# EAGLE design LB_o3_RGB_LED-v03(rev2) (EAGLE 6.6.0)
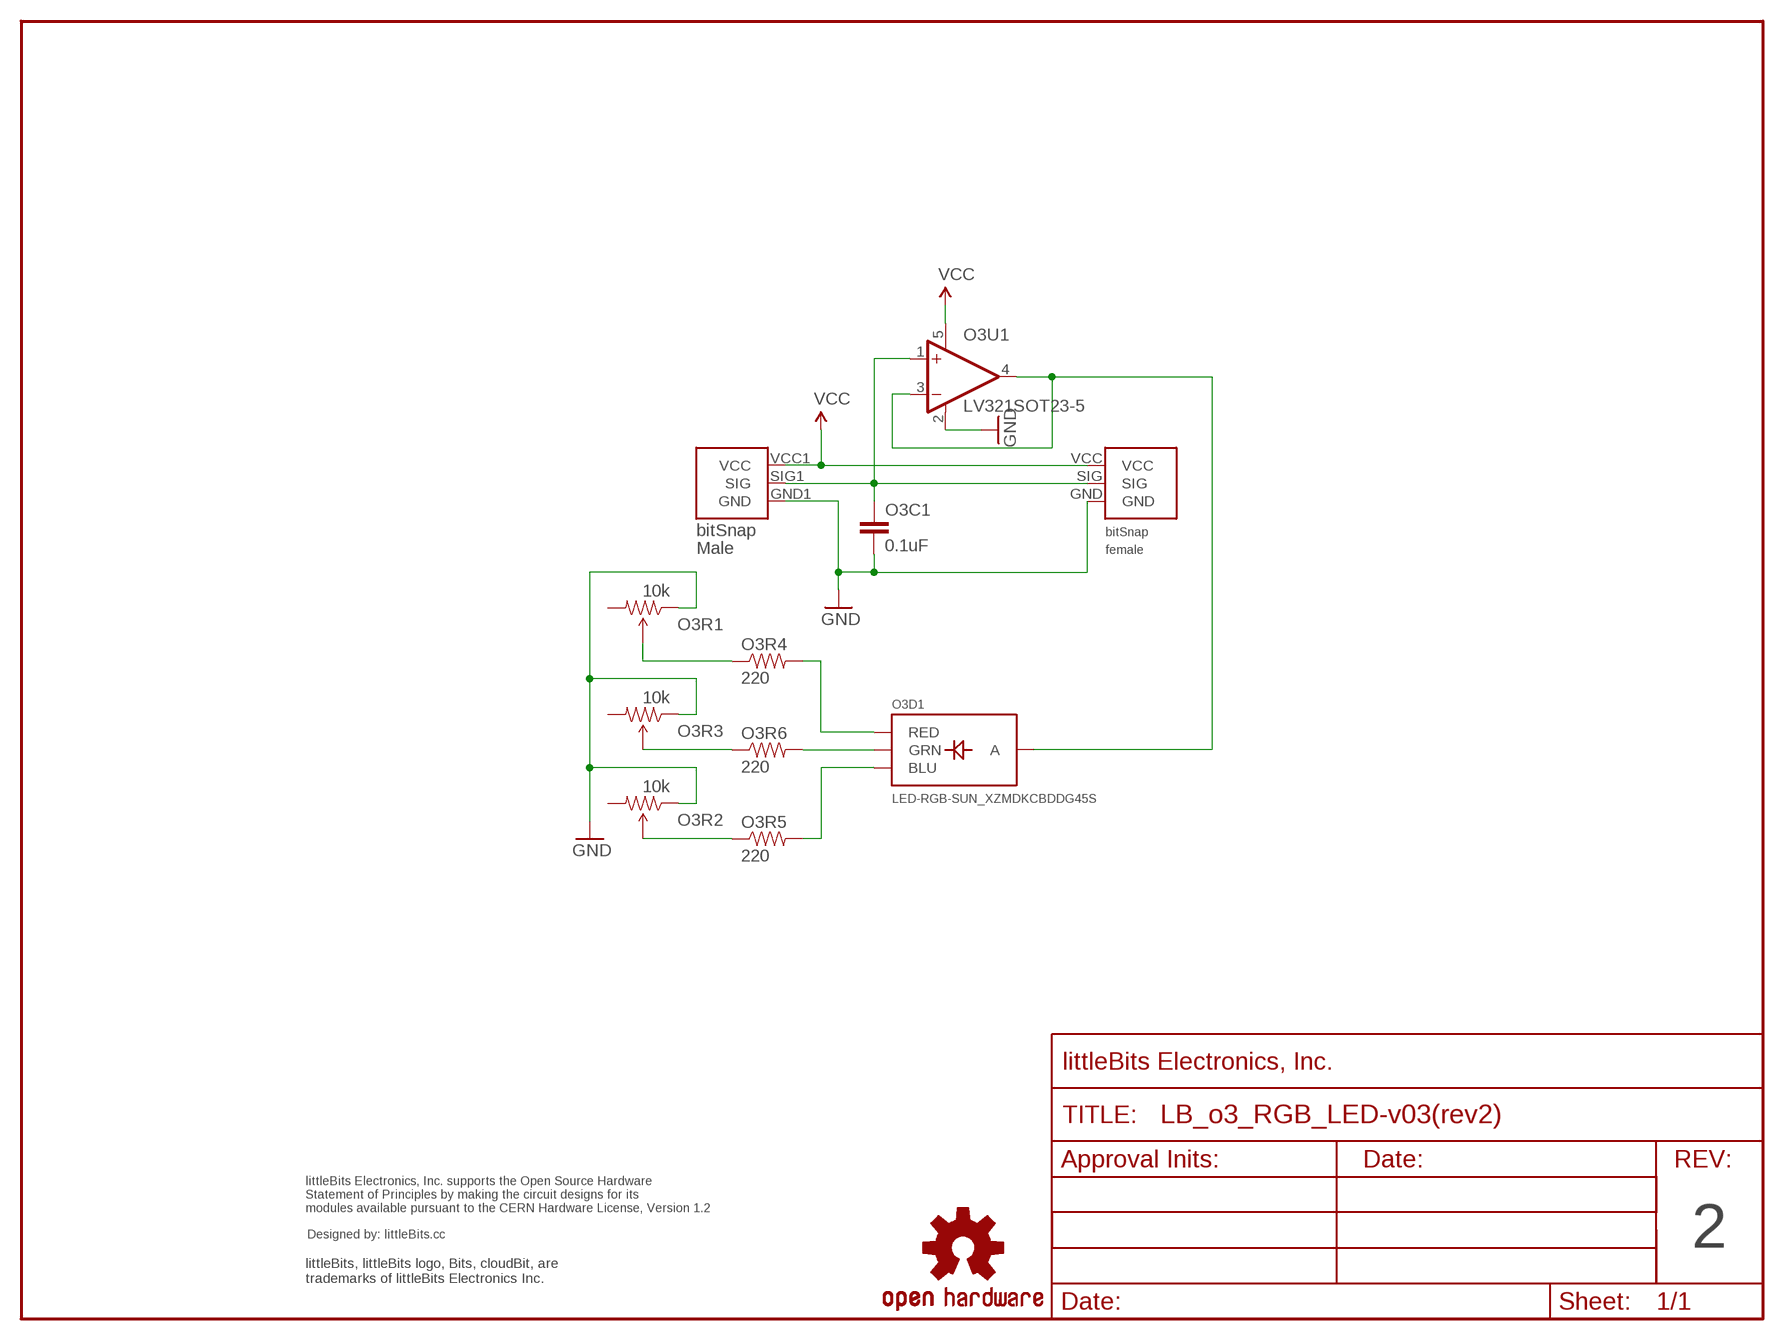
[diagram p0: schematic, sheet 1]

## Parts
O3BSF1  BITSNAP_V03_FEMALE  [BITSNAP_V03_FEMALE]
O3BSM1  BITSNAP_V03_MALE  [BITSNAP_V03_MALE]
O3C1  0.1uF  CAP0603-CAP  [0603-CAP]
O3D1  LED-RGB-SUN_XZMDKCBDDG45S  [LED-RGB-SUN_XZMDKCBDDG45S]
O3R1  10k  TRIMPOTSMD  [TRIMPOT-3MM]
O3R2  10k  TRIMPOTSMD  [TRIMPOT-3MM]
O3R3  10k  TRIMPOTSMD  [TRIMPOT-3MM]
O3R4  220  RESISTOR0603-RES  [0603-RES]
O3R5  220  RESISTOR0603-RES  [0603-RES]
O3R6  220  RESISTOR0603-RES  [0603-RES]
O3U1  LV321SOT23-5  [SOT23-5]
U$1  FRAME-LETTER-OHWOHW  [FABDWG01-OHW]
U$2  OSHWCREDIT  [OSHWCREDIT]
U$5  OSHW-LOGOL  [OSHW-LOGO-L]

## Nets
GND: O3BSF1.GND O3BSM1.GND1(GND) O3C1.2 O3R1.1(CCW) O3R2.1(CCW) O3R3.1(CCW) O3U1.2(V-)
LED: O3D1.2(A) O3U1.3(-IN) O3U1.4(OUT)
N$1: O3R1.2(WIPER) O3R4.1
N$2: O3D1.1(RED) O3R4.2
N$3: O3D1.4(GRN) O3R6.2
N$4: O3D1.3(BLU) O3R5.2
N$5: O3R2.2(WIPER) O3R5.1
N$6: O3R3.2(WIPER) O3R6.1
SIG: O3BSF1.SIG O3BSM1.SIG1(SIG) O3C1.1 O3U1.1(+IN)
VCC: O3BSF1.VCC O3BSM1.VCC1(VCC) O3U1.5(V+)
Unconnected: O3R1.3(CW) O3R2.3(CW) O3R3.3(CW)

## Notes on the sheet
- 2

## Library data of the parts
O3BSF1 = bitSnap:BITSNAP_V03_FEMALE
O3BSM1 = bitSnap:BITSNAP_V03_MALE
O3C1 = SparkFun:CAP: Capacitor Standard 0603 ceramic capacitor, and 0.1" leaded capacitor.
O3D1 = LITTLEBITS:LED-RGB-SUN_XZMDKCBDDG45S
O3R1-O3R3 = SparkFun:TRIMPOT
O3R4-O3R6 = SparkFun:RESISTOR: Resistor Basic schematic elements and footprints for 0603, 1206, and PTH 1/10th watt (small) resistors.
O3U1 = LITTLEBITS:LV321
U$1 = LITTLEBITS:FRAME-LETTER-OHW
U$2 = LITTLEBITS:OSHWCREDIT
U$5 = LITTLEBITS:OSHW-LOGO: Open Source Hardware Logo This logo indicates the piece of hardware it is found on incorporates a OSHW license and/or adheres to the definition of open source hardware found here: http://freedomdefined.org/OSHW

## Board
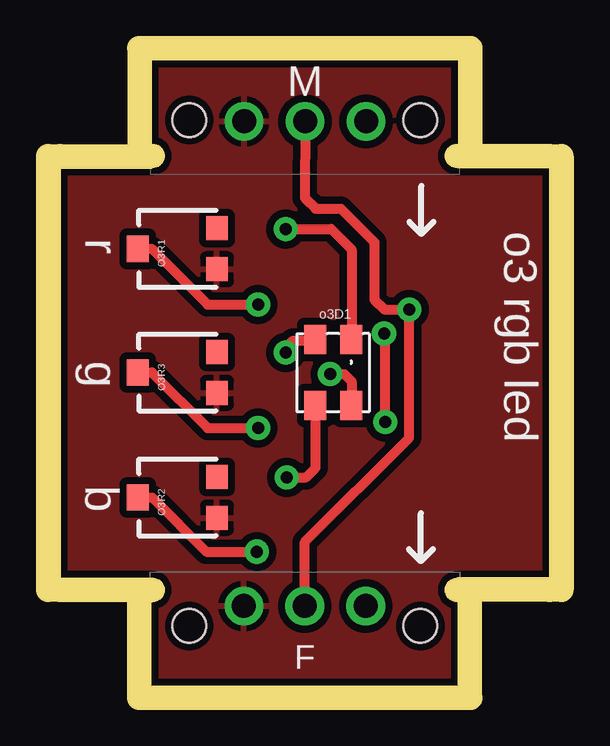
[diagram p1: board, top side]
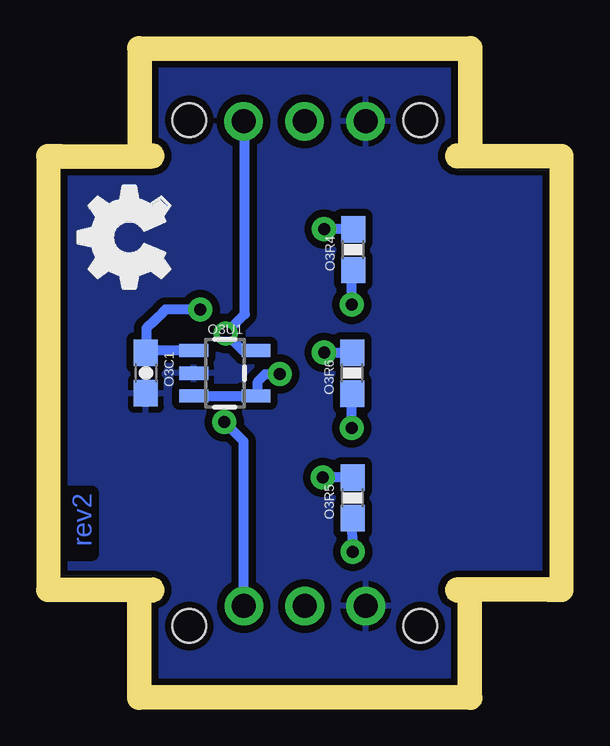
[diagram p2: board, bottom side, seen from below]

Size 20.4 x 26.1 mm. Coordinates in mm from the lower left corner, seen from the top.
Outline: 0,21.6 0,4.5
Outline: 20.4,4.5 20.4,21.6
Copper layers (1*16): Top 0.035mm / dielectric 1.5mm / Bottom 0.035mm
Design rules "default": minimum track width 8mil, minimum drill 20mil, track to track 8mil, track to pad 8mil, pad to pad 8mil, via to via 8mil, smd to smd 8mil, copper to edge 10mil, drill to drill 8mil, minimum pad ring 12mil, minimum via ring 10mil, stop-mask expansion 4mil, vias tented up to drill 25mil, thermal gap 10mil
Milling: 6 lines

### Footprints (pad centres in the part's own frame; a part is rotated, then mirrored left to right if it is on the bottom)
BITSNAP_V03_FEMALE = drill 1: GND 3.91,3.33; SIG 6.45,3.33; VCC 8.99,3.33 | hole 1.4: 1.63,2.5; 11.27,2.5
BITSNAP_V03_MALE = drill 1: GND1 8.98,2.56; SIG1 6.44,2.56; VCC1 3.9,2.56 | hole 1.4: 11.27,2.5; 1.63,2.5
0603-CAP = smd 1.1 x 1: 1 -0.85,0; 2 0.85,0
LED-RGB-SUN_XZMDKCBDDG45S = smd 0.9 x 1.2: 1 0,0; 2 0,2.75; 3 1.5,2.75; 4 1.5,0; 5 1.5,2.75
TRIMPOT-3MM = smd 1 x 0.9: 1 -0.85,-1.65; 3 0.85,-1.65 | smd 1.1 x 0.9: 2 0,1.65
0603-RES = smd 1.1 x 1: 1 -0.85,0; 2 0.85,0
SOT23-5 = smd 0.55 x 1.2: 1 -0.95,-1.3; 2 0,-1.3; 3 0.95,-1.3; 4 0.95,1.3; 5 -0.95,1.3

### Placement (x,y rotation side)
O3BSF1  3.75,0 0 top
O3BSM1  16.65,26.1 180 top
O3C1  16.82,13.05 270 bottom
O3D1  12.14,14.44 180 top
O3R1  4.89,18.23 90 top
O3R2  4.89,7.86 90 top
O3R3  4.89,13.07 90 top
O3R4  8.18,18.19 90 bottom
O3R5  8.21,7.84 90 bottom
O3R6  8.22,13.04 90 bottom
O3U1  13.53,13.04 270 bottom
U$1  0.15,0.15 0 top
U$2  -92.75,-62.45 0 top  (outside the outline)
U$5  -32.33,-67.81 0 top  (outside the outline)
U$6  [OSHW_FILLX150_NOTEXT]  15.83,15.75 0 top

### Tracks (layer width: path | path; a pad name or v marks a point on that pad's centre or on a via)
GND
  pour Top (isolate 0.305): 0.15,25.94 0.15,0.15 20.27,0.15 20.27,25.94
  pour Bottom (isolate 0.305): 0.15,25.94 0.15,0.15 20.27,0.15 20.27,25.94
LED  (via drill 0.5)
  Top 0.406: v11.25,13 11.85,13 12.15,12.7 12.15,11.7 12.14,11.7 O3D1.2
  Bottom 0.406: O3U1.3 O3U1.4 12.16,12.24 12.16,12.69 11.85,13 v11.25,13
N$1  (via drill 0.5)
  Top 0.406: O3R1.2 3.82,18.23 6.15,15.9 v8.25,15.9
  Bottom 0.406: v8.25,15.9 8.24,17.4 O3R4.1
N$2  (via drill 0.5)
  Top 0.406: v9.4,19.05 11.3,19.05 12.15,18.2 12.15,14.45 O3D1.1
  Bottom 0.406: O3R4.2 9.34,19.04 v9.4,19.05
N$3  (via drill 0.5)
  Top 0.406: v9.4,13.9 9.4,14.1 9.7,14.4 10.59,14.4 O3D1.4
  Bottom 0.406: O3R6.2 9.29,13.89 v9.4,13.9
N$4  (via drill 0.5)
  Top 0.406: v9.45,8.7 10.25,8.7 10.65,9.1 10.65,11.67 O3D1.3
  Bottom 0.406: O3R5.2 9.49,8.69 v9.45,8.7
N$5  (via drill 0.5)
  Top 0.406: O3R2.2 3.84,7.86 6.1,5.6 v8.2,5.6
  Bottom 0.406: v8.2,5.6 O3R5.1
N$6  (via drill 0.5)
  Top 0.406: O3R3.2 3.83,13.07 6.15,10.75 v8.25,10.75
  Bottom 0.406: O3R6.1 8.25,12.16 v8.25,10.75
SIG  (via drill 0.5)
  Top 0.406: O3BSM1.SIG1 10.2,20.35 10.65,19.9 11.7,19.9 13.1,18.5 13.1,16.1 13.5,15.7 v14.55,15.7 14.55,10.35 10.2,6 O3BSF1.SIG
  Bottom 0.406: O3U1.1 16.66,13.99 O3C1.1 16.8,14.92 16.1,15.6 16,15.7 v14.55,15.7
VCC  (via drill 0.5)
  Top 0.406: v13.55,11 13.55,14.65 v13.5,14.7
  Bottom 0.406: O3BSF1.VCC 12.75,10.2 v13.55,11 | O3BSM1.VCC1 12.7,23.1 12.7,15.5 v13.5,14.7 12.79,13.99 O3U1.5

### Text on the board
Bottom: rev2
tPlace: r | o3 rgb led | g | b
tNames: o3D1
Milling: 1mm DIA. ROUTER PATH
dxf: o3 RGB LED BIT PCB | 2 | LB-BIT-o3-RGBLED-v03-GERBER-rev2 (8-31-2012)